# EasyEDA Pro project 2021_ZT_1.eprj

# Schematic user
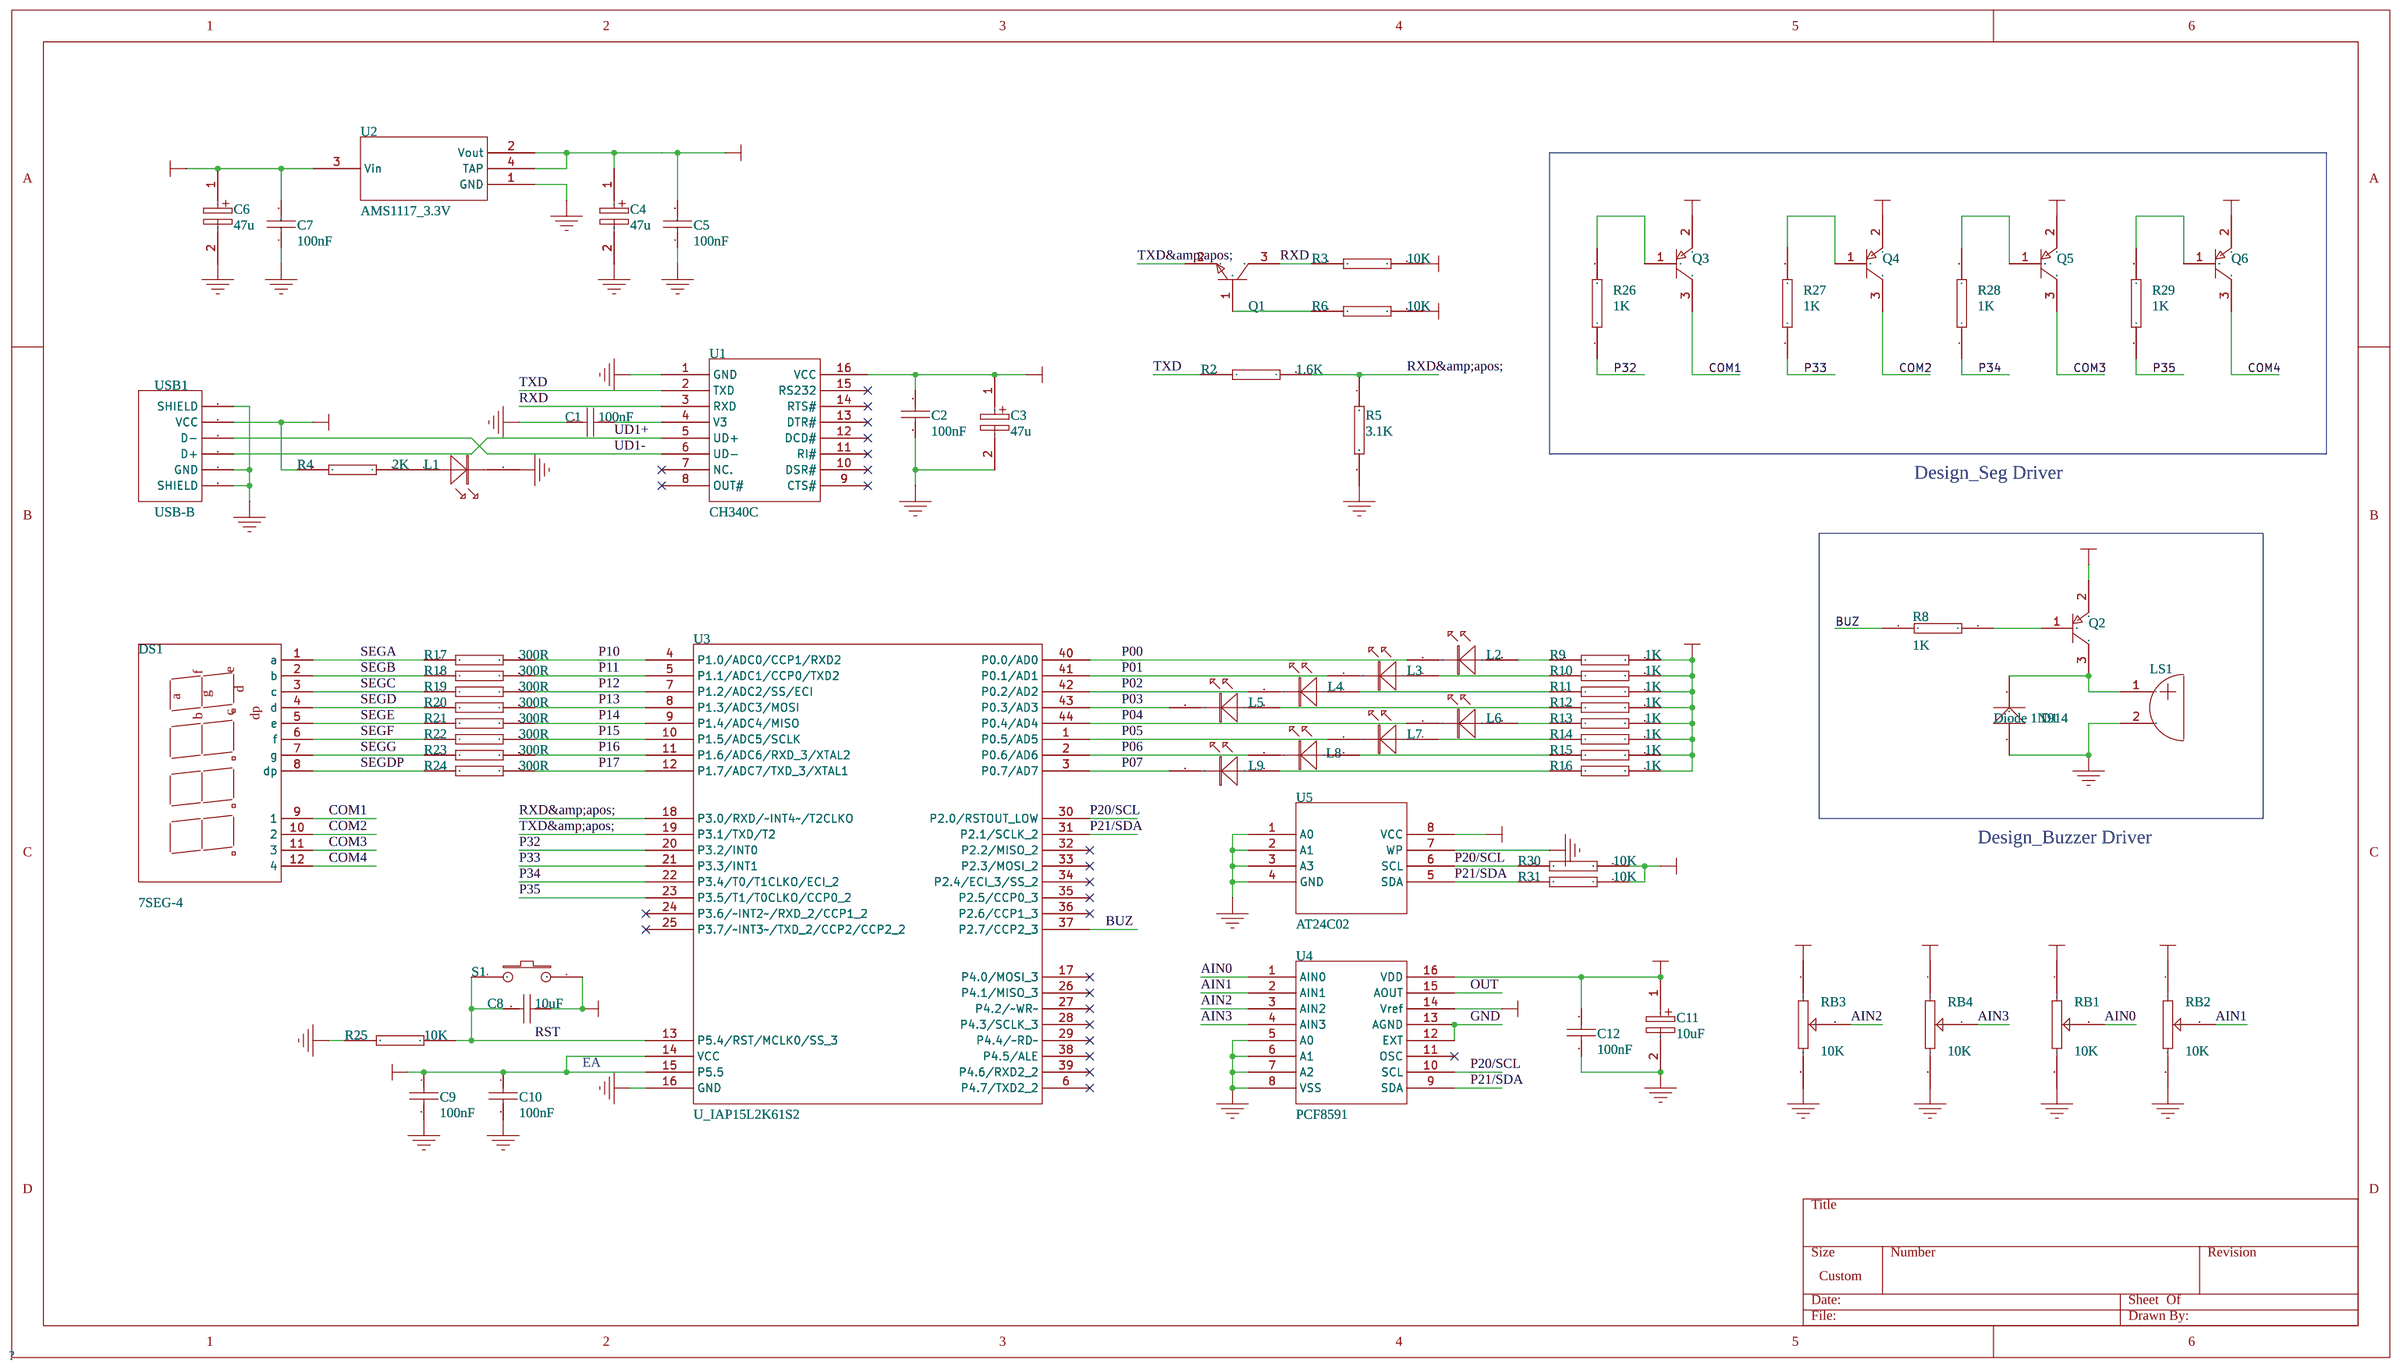
[diagram p0: schematic sheet]

## Parts
C1  100nF  [C0805]
C2  100nF  [C0805]
C3  47u  [CAP-2]
C4  47u  [CAP-2]
C5  100nF  [C0805]
C6  47u  [CAP-2]
C7  100nF  [C0805]
C8  10uF  [C0805]
C9  100nF  [C0805]
C10  100nF  [C0805]
C11  10uF  [CAP-2]
C12  100nF  [C0805]
D1  Diode 1N914  [DIODE]
DS1  7SEG-4  [D_SEG-0.36]
L1  LED  [LED0805]
L2  LED  [LED0805]
L3  LED  [LED0805]
L4  LED  [LED0805]
L5  LED  [LED0805]
L6  LED  [LED0805]
L7  LED  [LED0805]
L8  LED  [LED0805]
L9  LED  [LED0805]
LS1  S_BUZZER  [BUZZ]
Q1  8050-SOT23  [SOT23-3]
Q2  2N3906  [SOT23-3]
Q3  2N3906  [SOT23-3]
Q4  2N3906  [SOT23-3]
Q5  2N3906  [SOT23-3]
Q6  2N3906  [SOT23-3]
R2  1.6K  [R0805]
R3  10K  [R0805]
R4  2K  [R0805]
R5  3.1K  [R0805]
R6  10K  [R0805]
R8  1K  [R0805]
R9  1K  [R0805]
R10  1K  [R0805]
R11  1K  [R0805]
R12  1K  [R0805]
R13  1K  [R0805]
R14  1K  [R0805]
R15  1K  [R0805]
R16  1K  [R0805]
R17  300R  [R0805]
R18  300R  [R0805]
R19  300R  [R0805]
R20  300R  [R0805]
R21  300R  [R0805]
R22  300R  [R0805]
R23  300R  [R0805]
R24  300R  [R0805]
R25  10K  [R0805]
R26  1K  [R0805]
R27  1K  [R0805]
R28  1K  [R0805]
R29  1K  [R0805]
R30  10K  [R0805]
R31  10K  [R0805]
RB1  10K  [RB]
RB2  10K  [RB]
RB3  10K  [RB]
RB4  10K  [RB]
S1  SW-PB  [Switch]
U1  CH340C  [SO-16_N]
U2  AMS1117_3.3V  [SOT-223]
U3  U_IAP15L2K61S2  [LQFP-44]
U4  PCF8591  [SO-16_W]
U5  AT24C02  [SO-8]
USB1  USB-B  [USB-B]

## Library data of the parts
C1 C2 C9 C10 = 100nF: Design Item ID: CAP; Library Name: *
C3 C4 C6 = 47u: Electrolytic Capacitor; Library Name: user
C5 C7 = 100nF: Capacitor; ________: --Ƭ----; Design Item ID: C_CAP; Library Name: Altium-library
C8 = 10uF: Design Item ID: CAP; Library Name: *
C11 = 10uF: Electrolytic Capacitor; Design Item ID: ELECTRO2; Library Name: *
C12 = 100nF: Capacitor; Design Item ID: CAP; Library Name: *
D1 = Diode 1N914: High Conductance Fast Diode; Library Name: Miscellaneous Devices
DS1 = 7SEG-4: 4 Seven-Segment Display, Right Hand Decimal; Library Name: *
L1-L9 = LED: Library Name: *
LS1 = S_BUZZER: Library Name: Altium
Q1 = 8050-SOT23: PNP-S8050; ________: ------; Design Item ID: Q_NPN; Library Name: Altium
Q2-Q6 = 2N3906: PNP General Purpose Amplifier; Library Name: Miscellaneous Devices
R2 = 1.6K: Design Item ID: RES2; Library Name: *
R3 R6 R25 R30 R31 = 10K: Design Item ID: RES2; Library Name: *
R4 = 2K: Design Item ID: RES2; Library Name: *
R5 = ?: Design Item ID: RES2; Library Name: *
R8-R16 R26-R29 = 1K: Design Item ID: RES2; Library Name: *
R17-R24 = 300R: Design Item ID: RES2; Library Name: *
RB1-RB4 = 10K: Potentiometer; Design Item ID: POT2; Library Name: *
S1 = SW-PB: Library Name: user
U1 = CH340C: Library Name: user
U2 = AMS1117_3.3V: POWER; ________: --ѹоƬ; Design Item ID: U_ASM1117; Library Name: Altium-library
U3 = U_IAP15L2K61S2: MCU; ________: STC15ϵ-е-Ƭ--; Design Item ID: U_IAP15F2K61S2; Library Name: Company-library_2018--11--21--
U4 = PCF8591: Library Name: *
U5 = AT24C02: Library Name: *
USB1 = USB-B: Connector; Design Item ID: USB_A; Library Name: *

## Nets
+3V3: C4.1 C5.2 C8.2 C9.1 C10.1 C11.1 C12.2 Q2.2(E) Q3.2(E) Q4.2(E) Q5.2(E) Q6.2(E) R6.1 R9.2 R10.2 R11.2 R12.2 R13.2 R14.2 R15.2 R16.2 R30.1 R31.1 RB1.1 RB2.1 RB3.1 RB4.1 S1.2 U2.2(Vout) U2.4(TAP) U3.14(VCC) U3.15(P5.5) U4.14(Vref) U4.16(VDD) U5.8(VCC)
+5V: C2.1 C3.1 C6.1 C7.2 R3.1 R4.2 U1.16(VCC) U2.3(Vin) USB1.1(VCC)
GND: C1.1 C2.2 C3.2 C4.2 C5.1 C6.2 C7.1 C9.2 C10.2 C11.2 C12.1 D1.1(A) L1.2(K) LS1.2 R5.2 R25.2 RB1.3(2) RB2.3(2) RB3.3(2) RB4.3(2) U1.1(GND) U2.1(GND) U3.16(GND) U4.5(A0) U4.6(A1) U4.7(A2) U4.8(VSS) U4.12(EXT) U4.13(AGND) U5.1(A0) U5.2(A1) U5.3(A3) U5.4(GND) U5.7(WP) USB1.4(GND) USB1.5(SHIELD) USB1.6(SHIELD)
AIN0: RB1.2(W) U4.1(AIN0)
AIN1: RB2.2(W) U4.2(AIN1)
AIN2: RB3.2(W) U4.3(AIN2)
AIN3: RB4.2(W) U4.4(AIN3)
BUZ: R8.1 U3.37(P2.7/CCP2_3)
COM1: DS1.9(1) Q3.3(C)
COM2: DS1.10(2) Q4.3(C)
COM3: DS1.11(3) Q5.3(C)
COM4: DS1.12(4) Q6.3(C)
OUT: U4.15(AOUT)
P00: L2.2(K) U3.40(P0.0/AD0)
P01: L3.2(K) U3.41(P0.1/AD1)
P02: L4.2(K) U3.42(P0.2/AD2)
P03: L5.2(K) U3.43(P0.3/AD3)
P04: L6.2(K) U3.44(P0.4/AD4)
P05: L7.2(K) U3.1(P0.5/AD5)
P06: L8.2(K) U3.2(P0.6/AD6)
P07: L9.2(K) U3.3(P0.7/AD7)
P10: R17.2 U3.4(P1.0/ADC0/CCP1/RXD2)
P11: R18.2 U3.5(P1.1/ADC1/CCP0/TXD2)
P12: R19.2 U3.7(P1.2/ADC2/SS/ECI)
P13: R20.2 U3.8(P1.3/ADC3/MOSI)
P14: R21.2 U3.9(P1.4/ADC4/MISO)
P15: R22.2 U3.10(P1.5/ADC5/SCLK)
P16: R23.2 U3.11(P1.6/ADC6/RXD_3/XTAL2)
P17: R24.2 U3.12(P1.7/ADC7/TXD_3/XTAL1)
P20/SCL: R30.2 U3.30(P2.0/RSTOUT_LOW) U4.10(SCL) U5.6(SCL)
P21/SDA: R31.2 U3.31(P2.1/SCLK_2) U4.9(SDA) U5.5(SDA)
P32: R26.1 U3.20(P3.2/INT0)
P33: R27.1 U3.21(P3.3/INT1)
P34: R28.1 U3.22(P3.4/T0/T1CLKO/ECI_2)
P35: R29.1 U3.23(P3.5/T1/T0CLKO/CCP0_2)
RST: C8.1 R25.1 S1.1 U3.13(P5.4/RST/MCLK0/SS_3)
RXD: Q1.3(C) R3.2 U1.3(RXD)
RXD&amp;apos;: R2.1 R5.1 U3.18(P3.0/RXD/~INT4~/T2CLKO)
SEGA: DS1.1(a) R17.1
SEGB: DS1.2(b) R18.1
SEGC: DS1.3(c) R19.1
SEGD: DS1.4(d) R20.1
SEGDP: DS1.8(dp) R24.1
SEGE: DS1.5(e) R21.1
SEGF: DS1.6(f) R22.1
SEGG: DS1.7(g) R23.1
TXD: R2.2 U1.2(TXD)
TXD&amp;apos;: Q1.2(E) U3.19(P3.1/TXD/T2)
UD1+: U1.5(UD+) USB1.3(D+)
UD1-: U1.6(UD-) USB1.2(D-)
$1N776: L2.1(A) R9.1
$1N777: L4.1(A) R11.1
$1N778: L5.1(A) R12.1
$1N779: L7.1(A) R14.1
$1N780: L8.1(A) R15.1
$1N781: L9.1(A) R16.1
$1N782: L3.1(A) R10.1
$1N783: L6.1(A) R13.1
$1N790: C1.2 U1.4(V3)
$1N933: Q1.1(B) R6.2
$1N948: L1.1(A) R4.1
$1N2621: Q3.1(B) R26.2
$1N2633: Q4.1(B) R27.2
$1N2638: Q5.1(B) R28.2
$1N2643: Q6.1(B) R29.2
$1N2888: Q2.1(B) R8.2
$1N2903: D1.2(K) LS1.1 Q2.3(C)

Not connected (* = marked no-connect by the designer): U1 7(NC.)* 8(OUT#)* 9(CTS#)* 10(DSR#)* 11(RI#)* 12(DCD#)* 13(DTR#)* 14(RTS#)* 15(RS232)*; U3 6(P4.7/TXD2_2)* 17(P4.0/MOSI_3)* 24(P3.6/~INT2~/RXD_2/CCP1_2)* 25(P3.7/~INT3~/TXD_2/CCP2/CCP2_2)* 26(P4.1/MISO_3)* 27(P4.2/~WR~)* 28(P4.3/SCLK_3)* 29(P4.4/~RD~)* 32(P2.2/MISO_2)* 33(P2.3/MOSI_2)* 34(P2.4/ECI_3/SS_2)* 35(P2.5/CCP0_3)* 36(P2.6/CCP1_3)* 38(P4.5/ALE)* 39(P4.6/RXD2_2)*; U4 11(OSC)*

## Notes on the sheet
- Design_Seg Driver
- Design_Buzzer Driver
- EA

# Board user
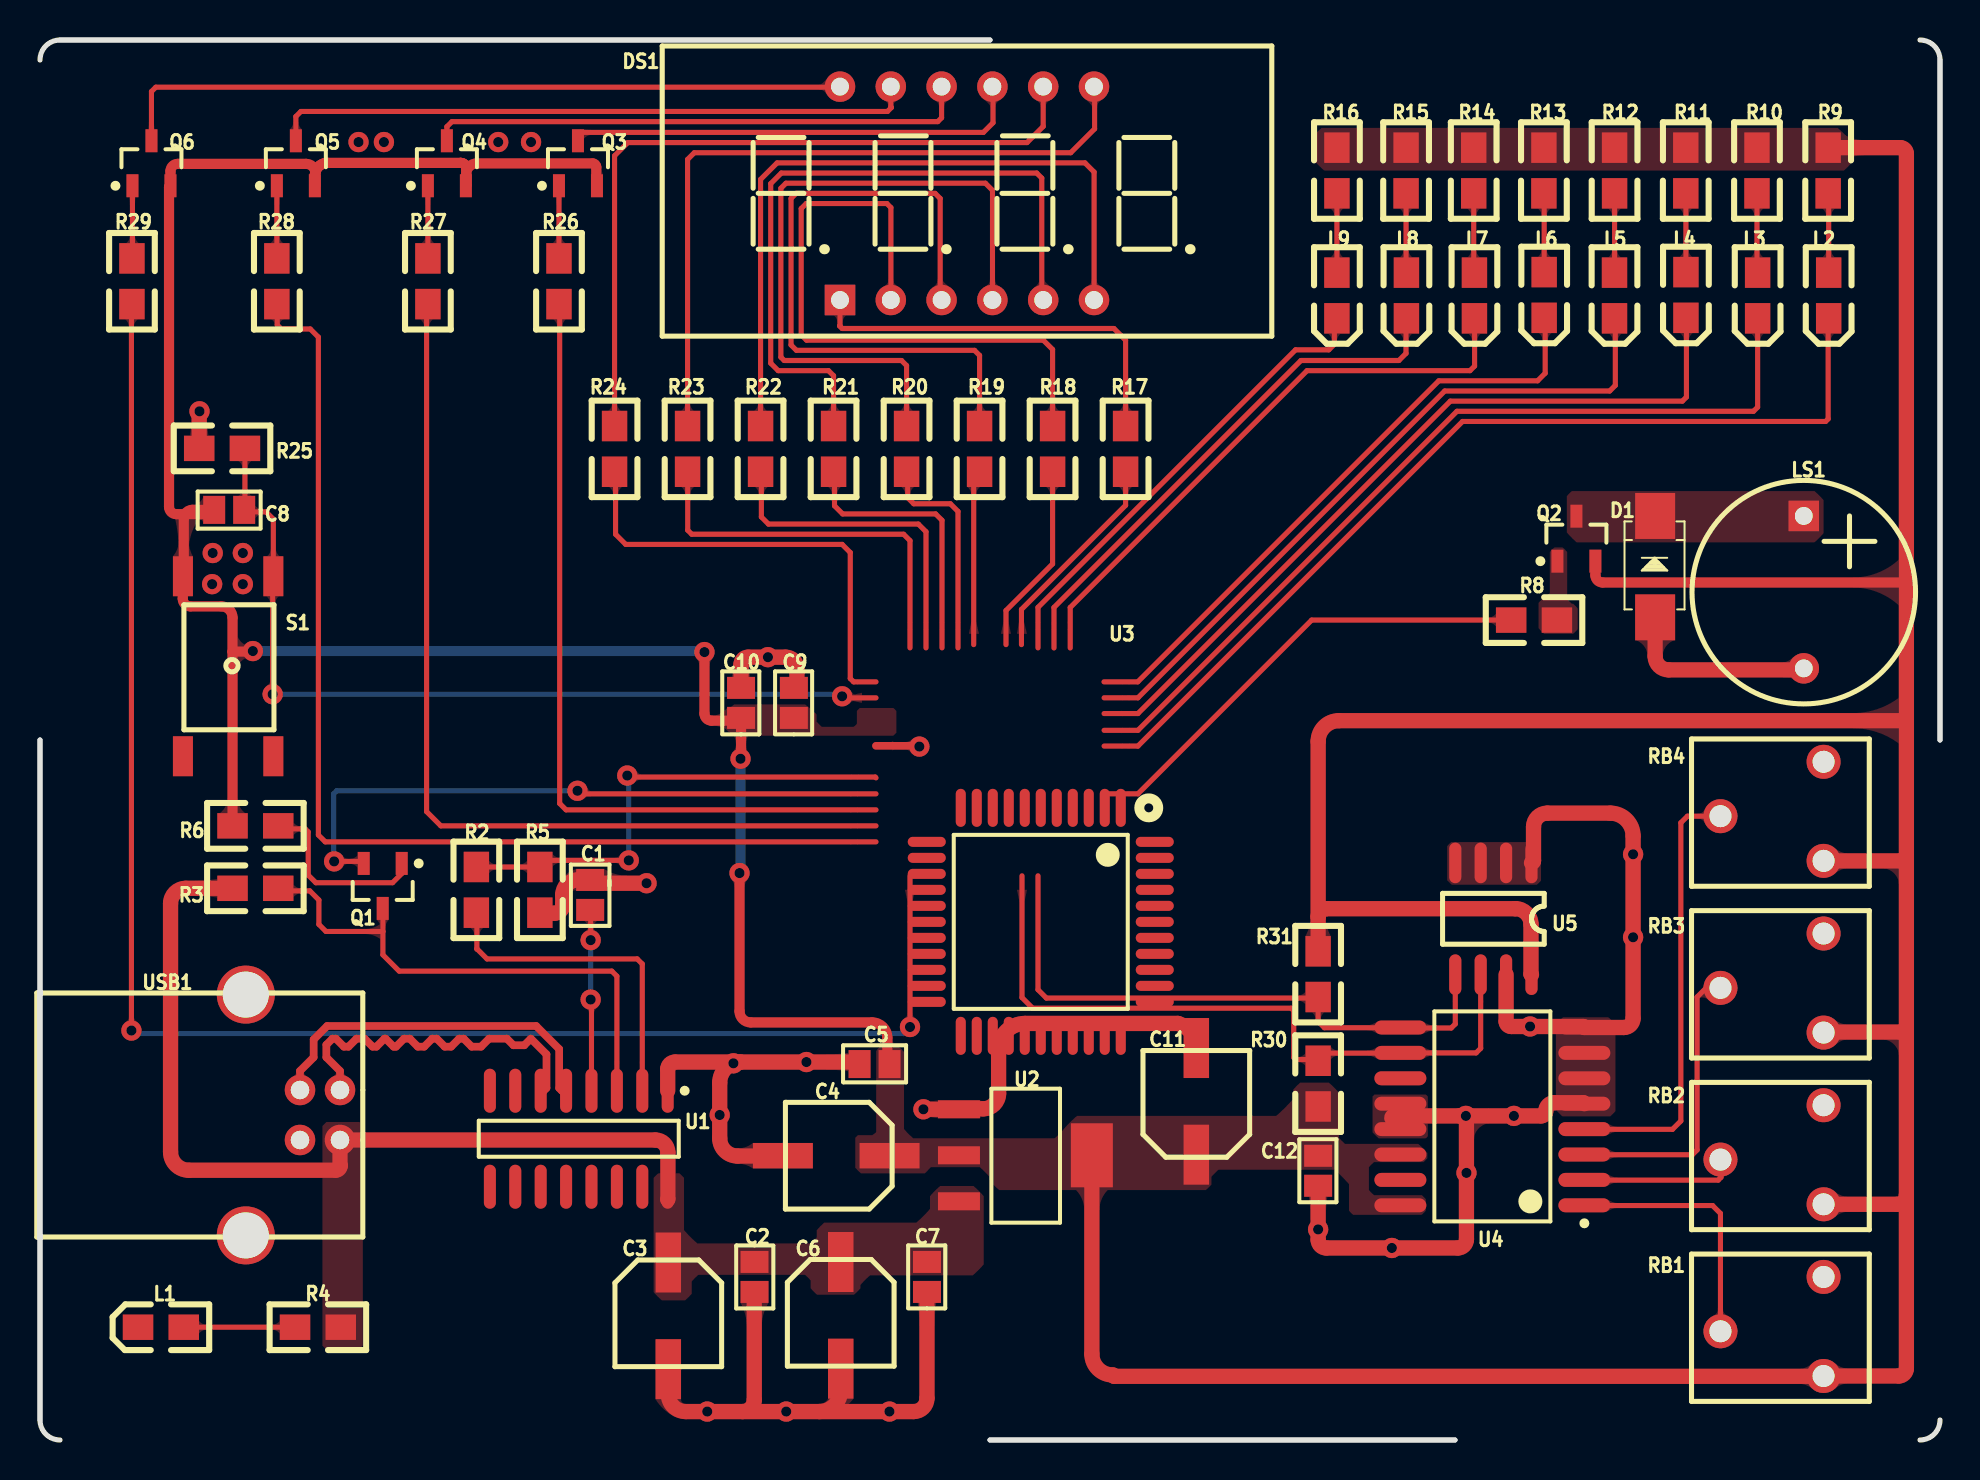
[diagram p1: board, top side]
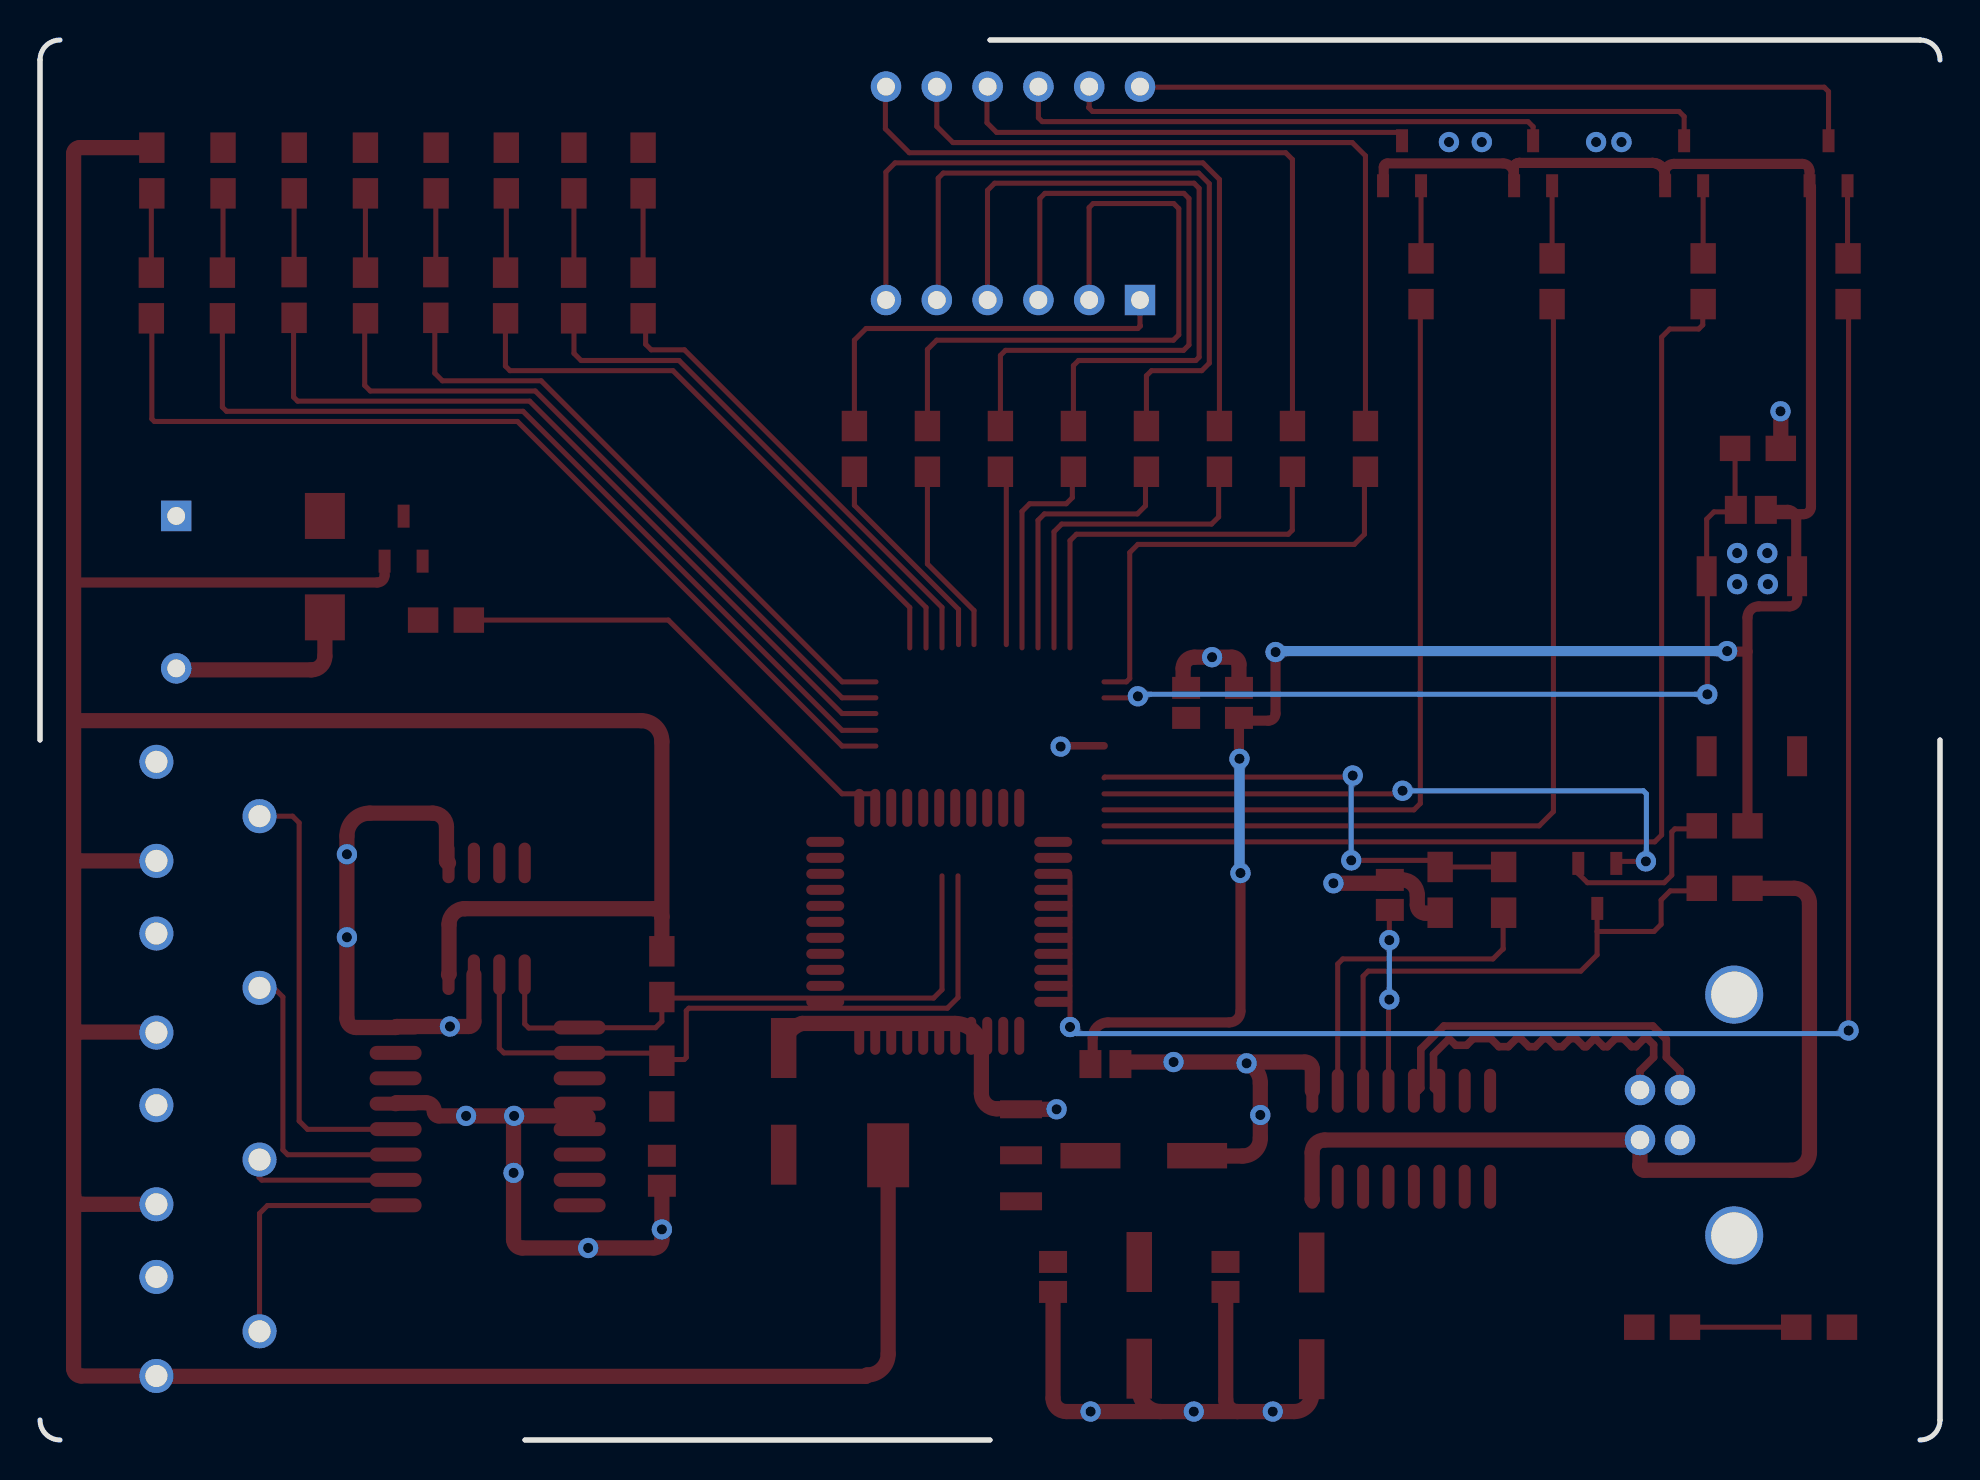
[diagram p2: board, bottom side, seen from below]

Outline 95 x 70 mm; copper layers: Top Layer, Bottom Layer. Coordinates in mm from the lower left corner of the outline.
Outline path: 0,69 arc(0.29,69.71) 1,70 ; 1,70 47.5,70 1,70 ; 0,1 0,35 0,1 ; 0,1 arc(0.29,0.29) 1,0 ; 94,70 arc(94.71,69.71) 95,69 ; 95,69 95,35 95,69 ; 95,1 arc(94.71,0.29) 94,0 ; 47.5,0 70.75,0 47.5,0
Stack: Top Layer 0.0356mm / SUBSTRATE1 0.32mm FR-4 er 4.8 / Bottom Layer 0.0356mm

## Design rules (mm)
net UD1-: DP1
net UD1+: DP1
template: 用户自定义配置
spacing Clearance (default): track to track 0.254, other pairs 0.254 to 0.762
track width Width (default): min 0.254, default 0.254, max 5.08
track width 3V3: min 0.508, default 0.508, max 2.54
track width +5V: min 0.254, default 0.762, max 2.54
differential pair DiffPairsRouting (default): width min 0.381, default 0.381, max 0.381; gap min 0.254, default 0.254
via RoutingVias (default): diameter min 1.016, default 1.016, max 2.54; hole min 0.508, default 0.508, max 2.54
net +5V uses +5V
net GND uses +5V
net +3V3 uses 3V3

## Placement (name value [footprint] x y rotation side)
C1  100nF  [C0805]  27.51 27.25 270 top
C2  100nF  [C0805]  35.73 8.15 270 top
C3  47u  [CAP-2]  30.91 7.24 270 top
C4  47u  [CAP-2]  40.84 14.72 180 top
C5  100nF  [C0805]  41.73 18.8 0 top
C6  47u  [CAP-2]  39.53 7.26 270 top
C7  100nF  [C0805]  44.35 8.15 90 top
C8  10uF  [C0805]  9.46 46.51 180 top
C9  100nF  [C0805]  37.69 36.86 90 top
C10  100nF  [C0805]  35.05 36.86 90 top
C11  10uF  [CAP-2]  58.32 15.9 90 top
C12  100nF  [C0805]  63.91 13.46 90 top
D1  Diode 1N914  [DIODE]  80.76 41.12 90 top
DS1  7SEG-4  [D_SEG-0.36]  40 57 0 top
L1  LED  [LED0805]  4.9 5.64 0 top
L2  LED  [LED0805]  89.43 56.08 90 top
L3  LED  [LED0805]  85.88 56.08 90 top
L4  LED  [LED0805]  82.3 56.11 90 top
L5  LED  [LED0805]  78.72 56.08 90 top
L6  LED  [LED0805]  75.21 56.11 90 top
L7  LED  [LED0805]  71.72 56.08 90 top
L8  LED  [LED0805]  68.32 56.08 90 top
L9  LED  [LED0805]  64.84 56.08 90 top
LS1  S_BUZZER  [BUZZ]  88.19 46.2 270 top
Q1  8050-SOT23  [SOT23-3]  18.08 28.83 270 top
Q2  2N3906  [SOT23-3]  75.87 43.94 90 top
Q3  2N3906  [SOT23-3]  25.95 62.71 90 top
Q4  2N3906  [SOT23-3]  19.39 62.71 90 top
Q5  2N3906  [SOT23-3]  11.84 62.71 90 top
Q6  2N3906  [SOT23-3]  4.62 62.71 90 top
R2  1.6K  [R0805]  21.82 28.65 270 top
R3  10K  [R0805]  9.63 27.58 0 top
R4  2K  [R0805]  12.75 5.64 0 top
R5  3.1K  [R0805]  24.99 28.65 270 top
R6  10K  [R0805]  9.63 30.71 0 top
R8  1K  [R0805]  73.56 41 0 top
R9  1K  [R0805]  89.41 62.33 90 top
R10  1K  [R0805]  85.85 62.33 90 top
R11  1K  [R0805]  82.29 62.33 90 top
R12  1K  [R0805]  78.73 62.33 90 top
R13  1K  [R0805]  75.19 62.33 90 top
R14  1K  [R0805]  71.69 62.33 90 top
R15  1K  [R0805]  68.3 62.33 90 top
R16  1K  [R0805]  64.85 62.33 90 top
R17  300R  [R0805]  54.28 50.7 270 top
R18  300R  [R0805]  50.63 50.7 270 top
R19  300R  [R0805]  46.98 50.7 270 top
R20  300R  [R0805]  43.33 50.7 270 top
R21  300R  [R0805]  39.68 50.7 270 top
R22  300R  [R0805]  36.03 50.7 270 top
R23  300R  [R0805]  32.38 50.7 270 top
R24  300R  [R0805]  28.73 50.7 270 top
R25  10K  [R0805]  10.25 49.58 180 top
R26  1K  [R0805]  25.95 56.79 90 top
R27  1K  [R0805]  19.39 56.79 90 top
R28  1K  [R0805]  11.84 56.79 90 top
R29  1K  [R0805]  4.6 56.79 90 top
R30  10K  [R0805]  63.91 16.68 90 top
R31  10K  [R0805]  63.91 24.44 270 top
RB1  10K  [RB]  89.18 3.2 270 top
RB2  10K  [RB]  89.18 11.79 270 top
RB3  10K  [RB]  89.18 20.37 270 top
RB4  10K  [RB]  89.18 28.96 270 top
S1  SW-PB  [Switch]  9.46 38.68 90 top
U1  CH340C  [SO-16_N]  26.94 15.06 270 top
U2  AMS1117_3.3V  [SOT-223]  45.95 16.54 0 top
U3  U_IAP15L2K61S2  [LQFP-44]  47.5 33.91 270 top
U4  PCF8591  [SO-16_W]  72.62 16.18 180 top
U5  AT24C02  [SO-8]  74.57 28.85 270 top
USB1  -  [USB-B]  15 15 270 top

## Footprints (pads in the part's own frame, mm; a bottom-side part is the same pattern mirrored in y, then rotated)
BUZZ
  rect 1.524x1.524 hole 0.889: 1(0,0)
  round 1.524 hole 0.889: 2(7.62,0)
C0805
  rect 1.1x1.4 smd: 1(-0.75,0) 2(0.75,0)
CAP-2
  rect 3x1.274 smd: 1(-1.635,0.502) 2(3.699,0.502)
D_SEG-0.36
  rect 1.524x1.524 hole 0.889: 1(0,0)
  round 1.524 hole 0.889: 2(2.54,0) 3(5.08,0) 4(7.62,0) 5(10.16,0) 6(12.7,0) 7(12.7,10.668) 8(10.16,10.668) 9(7.62,10.668) 10(5.08,10.668) 11(2.54,10.668) 12(0,10.668)
DIODE
  rect 2.3x2 smd: 1(0.01,0) 2(5.08,0)
LED0805
  rect 1.524x1.27 smd: 1(2.286,0) 2(0,0)
LQFP-44
  oval 1.9x0.5 smd: 1(2.301,6.54) 2(2.301,5.74) 3(2.301,4.94) 4(2.301,4.14) 5(2.301,3.34) 6(2.301,2.54) 7(2.301,1.74) 8(2.301,0.94) 9(2.301,0.14) 10(2.301,-0.66) 11(2.301,-1.46) 23(13.701,-1.46) 24(13.701,-0.66) 25(13.701,0.14) 26(13.701,0.94) 27(13.701,1.74) 28(13.701,2.54) 29(13.701,3.34) 30(13.701,4.14) 31(13.701,4.94) 32(13.701,5.74) 33(13.701,6.54)
  oval 0.5x1.9 smd: 12(4.001,-3.16) 13(4.801,-3.16) 14(5.601,-3.16) 15(6.401,-3.16) 16(7.201,-3.16) 17(8.001,-3.16) 18(8.801,-3.16) 19(9.601,-3.16) 20(10.401,-3.16) 21(11.201,-3.16) 22(12.001,-3.16) 34(12.001,8.24) 35(11.201,8.24) 36(10.401,8.24) 37(9.601,8.24) 38(8.801,8.24) 39(8.001,8.24) 40(7.201,8.24) 41(6.401,8.24) 42(5.601,8.24) 43(4.801,8.24) 44(4.001,8.24)
R0805
  rect 1.524x1.27 smd: 1(0,0) 2(2.286,0)
RB
  round 1.7 hole 1.1: 1(0,0) 2(-2.235,-5.156) 3(-4.953,0)
SO-8
  oval 2.032x0.61 smd: 1(0,0) 2(0,-1.27) 3(0,-2.54) 4(0,-3.81) 5(5.588,-3.81) 6(5.588,-2.54) 7(5.588,-1.27) 8(5.588,0)
SO-16_N
  oval 2.2x0.6 smd: 1(-2.4,4.445) 2(-2.4,3.175) 3(-2.4,1.905) 4(-2.4,0.635) 5(-2.4,-0.635) 6(-2.4,-1.905) 7(-2.4,-3.175) 8(-2.4,-4.445) 9(2.4,-4.445) 10(2.4,-3.175) 11(2.4,-1.905) 12(2.4,-0.635) 13(2.4,0.635) 14(2.4,1.905) 15(2.4,3.175) 16(2.4,4.445)
SO-16_W
  oval 2.6x0.7 smd: 1(-4.6,4.445) 2(-4.6,3.175) 3(-4.6,1.905) 4(-4.6,0.635) 5(-4.6,-0.635) 6(-4.6,-1.905) 7(-4.6,-3.175) 8(-4.6,-4.445) 9(4.6,-4.445) 10(4.6,-3.175) 11(4.6,-1.905) 12(4.6,-0.635) 13(4.6,0.635) 14(4.6,1.905) 15(4.6,3.175) 16(4.6,4.445)
SOT23-3
  rect 1.15x0.6 smd: 1(0,0) 2(0,-1.9) 3(2.25,-0.95)
SOT-223
  rect 2.1x0.9 smd: 1(0,0) 2(0,-2.3) 3(0,-4.6)
  rect 2.1x3.2 smd: 4(6.644,-2.3)
Switch
  rect 2x1 smd: 1(4.503,-2.208) 2(4.503,2.312) 3(-4.497,2.312) 4(-4.497,-2.208)
USB-B
  round 1.524 hole 0.92: 1(0,0) 2(-2.5,0) 3(-2.5,-2) 4(0,-2)
  round 2.9 hole 2.3: 5(-7.27,-4.71) 6(4.77,-4.71)

## Nets
As in the schematic, except:
RXD&APOS;: R2.1 R5.1 U3.18
TXD&APOS;: Q1.2 U3.19

Pads without a net: S1 3 4; U1 7 8 9 10 11 12 13 14 15; U3 6 17 24 25 26 27 28 29 32 33 34 35 36 38 39; U4 11

## Via types
v1: diameter 1.016, hole 0.508, Top Layer to Bottom Layer, 41 vias

## Routing (per net, layer and track width the routed paths; a pad name or vN(x,y) marks a point on that pad's centre or on a via; arc(x,y) is an arc through that point)
+3V3: length 320.4
  Top Layer w0.508: R6.1 9.63,39.42 ; 9.63,39.42 10.61,39.42 arc(10.63,39.43) v1(10.64,39.45) ; 9.63,39.42 9.63,41.12 arc(9.46,41.52) 9.07,41.68 7.52,41.68 arc(7.25,41.79) 7.14,42.06 7.14,43.18 arc(7.14,43.19) S1.2 arc(7.18,43.2) 7.19,43.23 7.19,46.08 arc(7.2,46.19) 7.25,46.29 ; C8.2 7.62,46.51 arc(7.4,46.45) 7.25,46.29 ; 21.31,62.73 21.31,63.3 ; 21.31,62.73 arc(21.31,62.72) 21.3,62.71 arc(21.31,62.72) 21.31,62.73 ; 21.31,63.3 21.31,63.58 ; 21.31,63.3 arc(21.47,63.67) 21.84,63.83 27.64,63.83 arc(27.76,63.78) 27.81,63.65 27.81,62.75 arc(27.82,62.72) Q3.2 ; v1(33.22,39.4) 33.22,36.32 arc(33.33,36.07) 33.58,35.97 34.91,35.97 arc(35.01,36.01) C10.1 35.05,34.09 arc(35.04,34.07) v1(35.03,34.06) ; 7.25,46.29 6.82,46.29 arc(6.56,46.4) 6.45,46.66 6.45,62.64 arc(6.47,62.69) Q6.2 6.52,63.44 arc(6.63,63.7) 6.88,63.81 13.31,63.81 arc(13.62,63.69) 13.77,63.39 ; 7.25,46.29 8.7,46.29 ; 14.38,63.86 21.03,63.86 ; 14.38,63.86 arc(13.99,63.73) 13.77,63.39 ; 14.38,63.86 arc(13.99,63.73) 13.77,63.39 ; 14.38,63.86 arc(13.99,63.73) 13.77,63.39 ; 21.03,63.86 arc(21.23,63.77) 21.31,63.58 ; 21.03,63.86 arc(21.23,63.77) 21.31,63.58 ; 21.03,63.86 arc(21.23,63.77) 21.31,63.58 ; v1(34.98,28.35) 34.98,21.44 arc(35.14,21.04) 35.53,20.88 41.6,20.88 arc(42.14,20.66) 42.37,20.12 42.37,18.91 arc(42.4,18.83) C5.2 ; Q2.2 77.77,43.24 arc(77.88,42.98) 78.13,42.88 93.3,42.88 arc(93.31,42.88) 93.32,42.89 ; 13.74,63.22 Q5.2 arc(13.76,62.72) 13.77,62.74 13.77,63.35 arc(13.77,63.37) 13.77,63.39 ; 13.74,63.22 arc(13.75,63.31) 13.77,63.39 ; 13.74,63.22 arc(13.75,63.31) 13.77,63.39 ; 13.74,63.22 arc(13.75,63.31) 13.77,63.39
  Top Layer w0.762: U2.4 52.59,4.3 arc(52.9,3.56) 53.65,3.25 53.71,3.18 89.06,3.18 89.13,3.25 arc(89.16,3.24) RB1.1 92.94,3.2 arc(93.21,3.31) 93.32,3.58 93.32,12.24 ; R9.2 93.01,64.62 arc(93.23,64.53) 93.32,64.31 93.32,35.97 ; RB2.1 92.86,11.79 arc(93.19,11.92) 93.32,12.24 ; 93.32,29.26 93.32,35.97 ; 93.32,29.26 93.32,20.7 ; 93.32,29.26 arc(93.23,29.05) 93.01,28.96 RB4.1 ; 93.32,35.97 64.95,35.97 arc(64.21,35.66) 63.91,34.92 63.91,26.16 ; 63.91,26.16 R31.1 ; 63.91,26.16 arc(64.03,26.45) 64.31,26.57 64.32,26.56 73.76,26.56 73.76,26.57 arc(74.32,26.34) 74.55,25.78 74.55,23.29 arc(74.56,23.27) U5.8 ; 93.32,20.7 93.32,12.24 ; 93.32,20.7 arc(93.23,20.49) 93.01,20.4 89.21,20.4 arc(89.19,20.39) RB3.1
  Bottom Layer w0.508: v1(10.64,39.45) 33.17,39.45 arc(33.21,39.43) v1(33.22,39.4) ; v1(35.03,34.06) 35.03,28.4 arc(35.01,28.36) v1(34.98,28.35)
+5V: length 45.5
  Top Layer w0.762: R3.1 7.29,27.58 arc(6.75,27.36) 6.53,26.82 6.53,14.4 arc(6.8,13.76) 7.44,13.49 14.78,13.49 arc(14.94,13.55) 15.01,13.72 arc(15,13.72) 15,13.73 USB1.1 30.77,15 arc(31.21,14.82) 31.39,14.38 31.39,12.04 arc(31.39,12.03) 31.38,12.03
GND: length 145.4
  Top Layer w0.381: 41.8,34.71 43.93,34.71 arc(43.96,34.7) v1(43.97,34.67)
  Top Layer w0.762: C12.1 v1(63.91,10.53) 63.91,10.01 arc(64.03,9.72) 64.31,9.6 v1(67.59,9.6) 70.89,9.6 arc(71.2,9.73) 71.32,10.03 v1(71.32,13.36) 71.32,15.88 arc(71.23,16.11) 70.99,16.2 ; v1(30.33,27.84) 27.67,27.84 arc(27.56,27.89) C1.1 26.89,28 arc(26.36,27.78) 26.14,27.25 26.14,26.75 arc(26.02,26.46) 25.73,26.34 25.02,26.34 arc(25,26.35) R5.2 ; 35.03,18.9 v1(38.32,18.9) 40.88,18.9 arc(40.95,18.87) C5.1 ; 35.03,18.9 31.75,18.9 arc(31.49,18.79) 31.38,18.53 U1.1 ; 35.03,18.9 arc(34.29,18.59) 33.99,17.86 v1(33.99,16.25) 33.99,15.09 arc(34.25,14.46) 34.87,14.2 37.13,14.2 arc(37.14,14.2) C4.2 ; C6.2 40.04,2.5 arc(39.72,1.74) 38.96,1.42 ; D1.1 80.76,39.18 arc(80.95,38.7) 81.43,38.51 88.11,38.51 arc(88.17,38.53) LS1.2 ; C7.1 44.35,2.08 arc(44.16,1.62) 43.69,1.42 v1(42.47,1.42) 38.96,1.42 ; v1(44.17,16.54) U2.1 arc(45.96,16.55) 45.97,16.56 47.17,16.56 arc(47.71,16.78) 47.93,17.32 47.93,19.51 arc(48.32,20.44) 49.25,20.83 56.89,20.83 arc(57.56,20.37) C11.2 ; 70.99,16.2 67.69,16.2 arc(67.62,16.18) 67.59,16.1 ; 70.99,16.2 v1(73.7,16.2) 75.06,16.2 arc(75.22,16.27) 75.29,16.43 arc(75.41,16.74) 75.72,16.87 77.17,16.87 arc(77.2,16.85) U4.5 ; U5.7 73.3,20.93 arc(73.38,20.75) 73.56,20.68 v1(74.5,20.68) 77.17,20.68 arc(77.2,20.66) U4.8 79.2,20.62 arc(79.52,20.76) 79.65,21.08 v1(79.65,25.14) v1(79.65,29.29) 79.65,30.2 arc(79.32,31.01) 78.51,31.34 75.36,31.34 arc(74.88,31.14) 74.68,30.66 74.68,28.96 arc(74.65,28.88) U5.1 ; 38.96,1.42 v1(37.31,1.42) 35.13,1.42 ; 35.13,1.42 v1(33.36,1.42) 32.28,1.42 arc(31.67,1.68) 31.41,2.29 C3.2 ; 35.13,1.42 arc(35.54,1.59) 35.71,2.01 35.71,7.39 arc(35.72,7.4) C2.2 ; C10.2 35.05,38.79 arc(35.16,39.04) 35.41,39.14 v1(36.4,39.14) 37.29,39.14 arc(37.68,38.98) 37.85,38.58 37.85,37.76 arc(37.8,37.65) C9.2 ; R25.2 7.96,51.42 arc(7.96,51.43) v1(7.98,51.44)
  vias: v1(8.64,44.35) v1(8.61,42.79) v1(10.14,44.35) v1(10.14,42.79) v1(15.93,64.9) v1(17.2,64.9) v1(22.91,64.9) v1(24.55,64.9) v1(34.67,18.83) v1(71.29,16.2)
AIN0: length 12.9
  Top Layer w0.254: RB1.2 84.02,11.33 83.63,11.72 77.22,11.72
AIN1: length 7.8
  Top Layer w0.254: 77.22,12.99 83.91,12.99 84.05,13.13 84.05,14 RB2.2
AIN2: length 14.7
  Top Layer w0.254: RB3.2 83.31,22.61 82.85,22.15 82.85,14.5 82.62,14.26 77.22,14.26
AIN3: length 22
  Top Layer w0.254: 77.22,15.53 81.62,15.53 82.04,15.95 82.04,30.86 82.37,31.19 RB4.2
BUZ: length 24
  Top Layer w0.254: 53.21,32.31 54.9,32.31 63.58,41 R8.1
COM1: length 23.1
  Top Layer w0.254: DS1.9 47.65,67.64 47.65,65.86 47.17,65.38 27,65.38 26.9,65.28 Q3.3
COM2: length 27.2
  Top Layer w0.254: Q4.3 20.34,65.66 20.6,65.92 44.89,65.92 45.08,66.11 DS1.10
COM3: length 32.2
  Top Layer w0.254: Q5.3 12.79,66.17 13.05,66.43 42.37,66.43 42.57,66.62 42.54,66.65 DS1.11
COM4: length 37
  Top Layer w0.254: DS1.12 39.97,67.64 5.79,67.64 5.57,67.42 5.57,64.96
P00: length 48
  Top Layer w0.254: 53.21,34.7 54.9,34.7 71.13,50.93 89.28,50.93 89.41,51.05 89.41,56.06 L2.2
P01: length 43.8
  Top Layer w0.254: 53.21,35.48 54.9,35.48 70.85,51.44 85.67,51.44 85.88,51.64 L3.2
P02: length 39.6
  Top Layer w0.254: 53.21,36.32 54.9,36.32 70.52,51.94 82.12,51.94 82.32,52.15 82.32,56.08 L4.2
P03: length 35.4
  Top Layer w0.254: 53.21,37.11 54.9,37.11 70.24,52.45 78.49,52.45 78.77,52.73 78.77,56.04 L5.2
P04: length 31.2
  Top Layer w0.254: L6.2 75.26,56.06 75.26,53.34 74.88,52.96 69.94,52.96 54.89,37.91 53.2,37.91
P05: length 29.6
  Top Layer w0.254: 51.51,39.6 51.51,41.63 63.35,53.47 71.5,53.47 71.73,53.7 71.73,56.08 L7.2
P06: length 26.6
  Top Layer w0.254: 50.7,39.6 50.7,41.63 63.05,53.97 67.94,53.97 68.3,54.33 68.3,56.06 L8.2
P07: length 23.6
  Top Layer w0.254: L9.2 64.72,55.96 64.72,54.79 64.44,54.51 62.78,54.51 49.9,41.63 49.9,39.61
P10: length 10.8
  Top Layer w0.254: R17.2 54.28,46.74 49.07,41.53 49.07,39.77
P11: length 9.6
  Top Layer w0.254: R18.2 50.63,43.8 48.3,41.47 48.3,39.77
P12: length 8.8
  Top Layer w0.254: 46.69,39.77 46.69,48.12 R19.2
P13: length 10.9
  Top Layer w0.254: 45.9,39.61 45.9,46.43 45.52,46.81 43.69,46.81 43.38,47.12 43.38,48.36 R20.2
P14: length 13.8
  Top Layer w0.254: 45.1,39.61 45.1,45.98 44.78,46.3 40.13,46.3 39.73,46.71 39.73,48.36 R21.2
P15: length 16.6
  Top Layer w0.254: R22.2 36.07,48.37 36.07,46.15 36.42,45.8 43.92,45.8 44.3,45.41 44.3,39.61
P16: length 19.6
  Top Layer w0.254: R23.2 32.38,48.41 32.38,45.49 32.59,45.29 43.18,45.29 43.5,44.97 43.5,39.61
P17: length 22.9
  Top Layer w0.254: 41.8,37.91 40.68,37.91 40.51,38.07 40.51,44.37 40.11,44.78 29.29,44.78 28.78,45.29 28.78,48.36 R24.2
P20/SCL: length 35.6
  Top Layer w0.254: U5.6 72.03,19.58 71.81,19.36 68.03,19.36 68.02,19.34 64.29,19.34 R30.2 63.84,19.02 62.79,19.02 62.69,19.13 62.69,21.46 62.56,21.59 49.63,21.59 49.1,22.12 49.1,28.21
P21/SDA: length 30.7
  Top Layer w0.254: 49.9,28.21 49.9,22.52 50.32,22.1 63.86,22.1 R31.2 63.91,20.93 64.22,20.61 68.02,20.61 68.04,20.6 70.56,20.6 70.76,20.8 U5.5
P32: length 40.9
  Top Layer w0.254: 41.8,31.51 26.3,31.51 25.98,31.83 25.98,56.76 R26.1
P33: length 48.2
  Top Layer w0.254: R27.1 19.33,56.73 19.33,31.42 20.04,30.71 41.8,30.71
P34: length 56.3
  Top Layer w0.254: R28.1 11.86,56.78 11.86,55.75 12.06,55.55 13.51,55.55 13.92,55.14 13.92,30.25 14.26,29.91 41.8,29.91
P35: length 83
  Top Layer w0.254: v1(43.5,20.65) 43.5,28.21 ; v1(4.57,20.47) 4.57,56.77 R29.1
  Bottom Layer w0.254: v1(43.5,20.65) 43.17,20.32 4.72,20.32 v1(4.57,20.47)
RST: length 43.8
  Top Layer w0.254: v1(11.63,37.29) 11.63,43.15 S1.1 11.67,46.04 11.3,46.41 10.31,46.41 C8.1 arc(10.24,46.52) 10.25,46.55 R25.1 ; 41.8,37.11 40.18,37.11 v1(40.11,37.19)
  Bottom Layer w0.254: v1(11.63,37.29) 40,37.29 v1(40.11,37.19)
RXD: length 27.8
  Top Layer w0.254: R3.2 12.04,27.46 13.49,27.46 13.94,27 13.94,25.78 14.3,25.43 17.14,25.43 ; 17.14,25.43 17.14,26.7 17.14,26.71 ; 17.14,25.43 17.14,24.26 17.96,23.44 28.59,23.44 28.84,23.19 28.84,16.83
RXD&APOS;: length 24.5
  Top Layer w0.254: v1(29.36,33.22) 29.44,33.15 41.76,33.15 41.8,33.11 ; v1(29.44,28.98) 25.32,28.98 R5.1 R2.1
  Bottom Layer w0.254: v1(29.44,28.98) 29.44,33.15 v1(29.36,33.22)
SEGA: length 20.2
  Top Layer w0.254: R17.1 54.28,54.99 53.7,55.58 40.11,55.58 39.98,55.7 40,55.72 DS1.1
SEGB: length 32.3
  Top Layer w0.254: R18.1 50.63,54.53 50.16,54.99 38.33,54.99 38.06,55.26 38.06,61.57 38.31,61.82 42.34,61.82 42.54,61.62 42.54,57 DS1.2
SEGC: length 33.3
  Top Layer w0.254: DS1.3 45.01,57.07 45.01,62.08 44.75,62.33 37.81,62.33 37.55,62.08 37.55,54.75 37.82,54.48 46.72,54.48 46.98,54.23 R19.1
SEGD: length 34.2
  Top Layer w0.254: DS1.4 47.62,57 47.62,62.48 47.27,62.84 37.3,62.84 37.04,62.59 37.04,54.14 37.21,53.97 43.07,53.97 43.33,53.72 R20.1
SEGDP: length 37.5
  Top Layer w0.254: DS1.8 50.16,65.68 49.35,64.87 29.39,64.87 28.73,64.21 R24.1
SEGE: length 34.9
  Top Layer w0.254: DS1.5 50.09,57.07 50.09,63.09 49.84,63.35 37.07,63.35 36.54,62.82 36.54,53.84 36.91,53.47 39.42,53.47 39.68,53.21 R21.1
SEGF: length 35.9
  Top Layer w0.254: R22.1 36.03,63.03 36.86,63.86 52.25,63.86 52.71,63.4 52.71,57 DS1.6
SEGG: length 36.4
  Top Layer w0.254: R23.1 32.38,64.03 32.72,64.36 51.54,64.36 52.73,65.56 52.73,67.64 DS1.7
TXD: length 17.7
  Top Layer w0.254: 30.11,16.83 30.11,23.8 29.86,24.05 22.35,24.05 21.84,24.56 ; 21.84,26.34 21.84,26.64 ; 21.84,26.34 21.84,24.56 ; 21.84,26.34 R2.2 ; 21.84,24.56 21.84,24.54
TXD&APOS;: length 32.2
  Top Layer w0.254: v1(26.87,32.46) 26.97,32.46 27.13,32.31 41.8,32.31 ; Q1.2 16.08,28.93 v1(14.71,28.93)
  Bottom Layer w0.254: v1(14.71,28.93) 14.68,28.96 14.68,32.31 14.83,32.46 v1(26.87,32.46)
UD1+: length 18.2
  Top Layer w0.381: USB1.3 13,18.45 13.68,19.14 13.68,20.02 14.36,20.7 24.81,20.7 25.96,19.55 25.96,17.6 26.09,17.46 U1.5
UD1-: length 18.3
  Top Layer w0.381: USB1.2 15,18.45 14.32,19.14 14.32,19.76 14.62,20.07 14.8,20.07 15.2,19.67 15.42,19.67 15.82,20.07 16.23,20.07 16.63,19.67 16.82,19.67 17.22,20.07 17.28,20.07 17.68,19.67 17.8,19.67 18.2,20.07 18.49,20.07 18.89,19.67 19.21,19.67 19.61,20.07 19.84,20.07 20.24,19.67 20.56,19.67 20.95,20.07 21.18,20.07 21.58,19.67 22.05,19.67 22.45,20.07 23.34,20.07 23.67,19.74 24.21,19.74 24.54,20.07 25.32,19.28 25.32,17.6 25.19,17.46 U1.6
$1N776: length 4
  Top Layer w0.254: L2.1 89.43,62.31 arc(89.43,62.32) R9.1
$1N777: length 3.9
  Top Layer w0.254: L4.1 82.3,62.32 arc(82.29,62.33) R11.1
$1N778: length 4
  Top Layer w0.254: R12.1 78.73,58.37 arc(78.73,58.37) L5.1
$1N779: length 4
  Top Layer w0.254: R14.1 71.69,58.4 arc(71.7,58.38) L7.1
$1N780: length 4
  Top Layer w0.254: R15.1 68.3,58.39 arc(68.31,58.37) L8.1
$1N781: length 4
  Top Layer w0.254: R16.1 64.85,58.37
$1N782: length 4
  Top Layer w0.254: R10.1 85.85,58.4 arc(85.86,58.38) L3.1
$1N783: length 3.9
  Top Layer w0.254: L6.1 75.21,62.32 arc(75.21,62.33) R13.1
$1N790: length 10
  Top Layer w0.254: v1(27.53,24.99) 27.53,26.56 arc(27.53,26.57) 27.51,26.58 ; 27.57,16.83 27.57,21.6 arc(27.57,21.61) 27.56,21.62 27.56,22 arc(27.55,22.01) v1(27.53,22.02)
  Bottom Layer w0.254: v1(27.53,22.02) v1(27.53,24.99) arc(27.5,24.9) 27.51,24.79
$1N933: length 9.4
  Top Layer w0.254: 11.91,30.66 12.01,30.56 13.26,30.56 13.41,30.4 13.41,28.25 13.79,27.86 17.63,27.86 18.08,28.32 18.08,28.91
$1N948: length 5.6
  Top Layer w0.254: L1.1 R4.1
$1N2621: length 3.6
  Top Layer w0.254: Q3.1 R26.2
$1N2633: length 3.6
  Top Layer w0.254: Q4.1 R27.2
$1N2638: length 3.6
  Top Layer w0.254: Q5.1 R28.2
$1N2643: length 3.6
  Top Layer w0.254: Q6.1 4.62,59.11 R29.2

## Copper pours and planes (outline as drawn; the poured copper is in the pictures)
+3V3 on Top Layer: 63.7,65.61 90.55,65.61 90.55,63.47 63.7,63.47
+3V3 on Top Layer: 34.14,36.78 42.82,36.78 42.82,35.22 34.14,35.22
+3V3 on Top Layer: 40.76,19.79 69.37,19.79 69.37,11.26 40.76,11.26
+5V on Top Layer: 30.68,13.33 47.18,13.33 47.18,6.99 30.68,6.99
+5V on Top Layer: 14.12,15.9 16.14,15.9 16.14,4.5 14.12,4.5
GND on Top Layer: -8.1,75.89 113.79,75.89 113.79,-17.91 -8.1,-17.91
GND on Top Layer: 75.79,21.13 78.78,21.13 78.78,16.18 75.79,16.18
GND on Top Layer: 66.62,17.27 69.39,17.27 69.39,15.08 66.62,15.08
GND on Top Layer: 70.36,29.9 75.05,29.9 75.05,27.77 70.36,27.77
GND on Bottom Layer: -5.89,76.33 98.37,76.33 98.37,-5.13 -5.89,-5.13
$1N2888 on Top Layer: 74.93,44.63 76.89,44.63 76.89,40.31 74.93,40.31
$1N2903 on Top Layer: 76.34,47.45 89.18,47.45 89.18,44.88 76.34,44.88

Small or netless copper shapes (teardrops, artwork), in the pictures only: 197 on Top Layer, 14 on Bottom Layer
